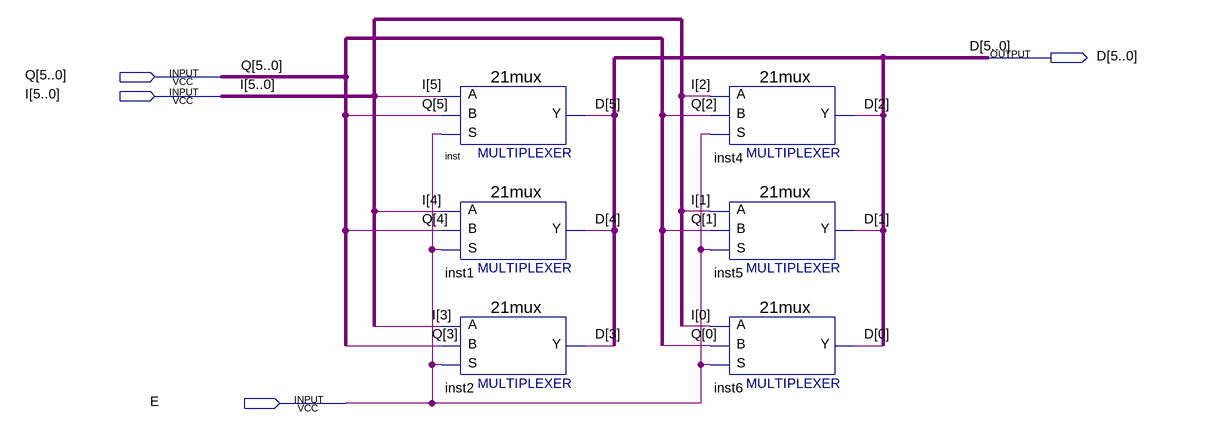
[diagram p0: schematic sheet]
// Quartus schematic RDin.bdf as structural Verilog: 6 symbols, 4 pins
module RDin (
  input  [5:0] Q,
  input  [5:0] I,
  input  E,
  output [5:0] D
);

  \21mux  inst (.S(E), .B(Q[5]), .A(I[5]), .Y(D[5]));
  \21mux  inst1 (.S(E), .B(Q[4]), .A(I[4]), .Y(D[4]));
  \21mux  inst2 (.S(E), .B(Q[3]), .A(I[3]), .Y(D[3]));
  \21mux  inst4 (.S(E), .B(Q[2]), .A(I[2]), .Y(D[2]));
  \21mux  inst5 (.S(E), .B(Q[1]), .A(I[1]), .Y(D[1]));
  \21mux  inst6 (.S(E), .B(Q[0]), .A(I[0]), .Y(D[0]));
endmodule
